# Altium schematic sheet [04] - CONNECTORS.SchDoc
size A4; DocumentNumber: 4; SheetNumber: 4; SheetTotal: 5
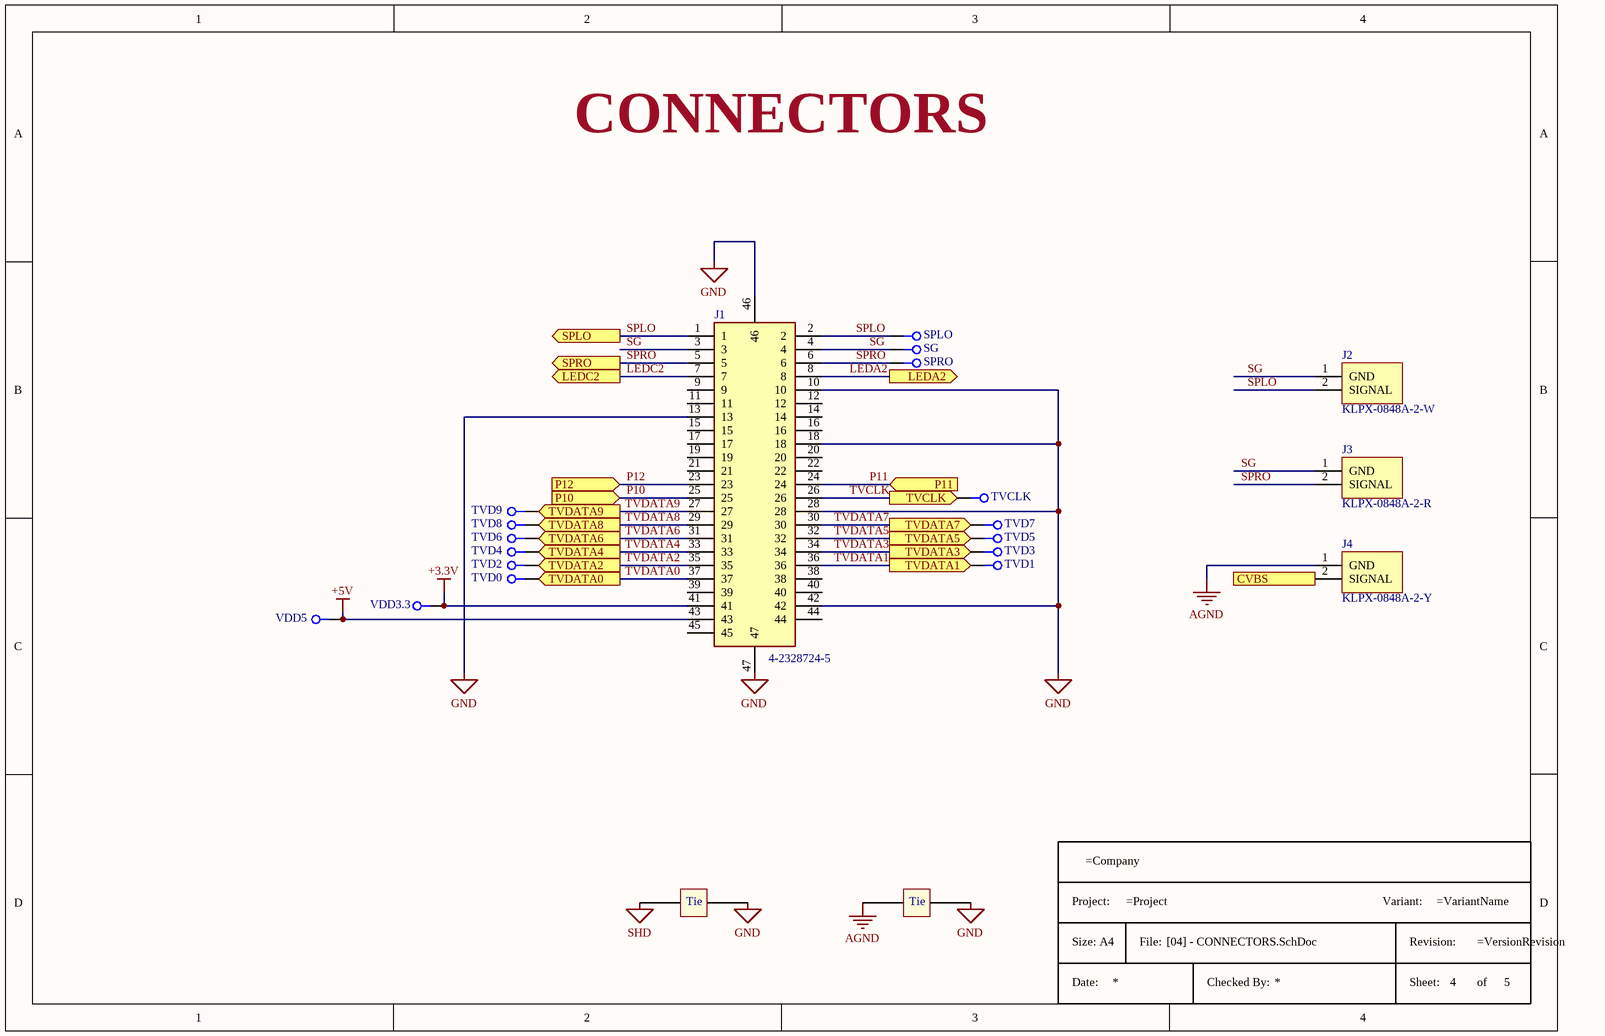
[diagram p0: [04] - CONNECTORS.SchDoc]

## Parts
*  Title Block A4  (value not drawn)  (graphical)
J1  4-2328724-5  [423287245]
J2  KLPX-0848A-2-W  [KLPX0848A2W]
J3  KLPX-0848A-2-R  [KLPX0848A2R]
J4  KLPX-0848A-2-Y  [KLPX0848A2Y]
SG  TP_25MILC  [TP_25C]  (value not drawn)  (no BOM)
SPLO  TP_25MILC  [TP_25C]  (value not drawn)  (no BOM)
SPRO  TP_25MILC  [TP_25C]  (value not drawn)  (no BOM)
T1  NET TIE  [NET_TIE]  (value not drawn)  (net tie, no BOM)
T2  NET TIE  [NET_TIE]  (value not drawn)  (net tie, no BOM)
TVCLK  TP_25MILC  [TP_25C]  (value not drawn)  (no BOM)
TVD0  TP_25MILC  [TP_25C]  (value not drawn)  (no BOM)
TVD1  TP_25MILC  [TP_25C]  (value not drawn)  (no BOM)
TVD2  TP_25MILC  [TP_25C]  (value not drawn)  (no BOM)
TVD3  TP_25MILC  [TP_25C]  (value not drawn)  (no BOM)
TVD4  TP_25MILC  [TP_25C]  (value not drawn)  (no BOM)
TVD5  TP_25MILC  [TP_25C]  (value not drawn)  (no BOM)
TVD6  TP_25MILC  [TP_25C]  (value not drawn)  (no BOM)
TVD7  TP_25MILC  [TP_25C]  (value not drawn)  (no BOM)
TVD8  TP_25MILC  [TP_25C]  (value not drawn)  (no BOM)
TVD9  TP_25MILC  [TP_25C]  (value not drawn)  (no BOM)
VDD3.3  TP_25MILC  [TP_25C]  (value not drawn)  (no BOM)
VDD5  TP_25MILC  [TP_25C]  (value not drawn)  (no BOM)

## Ports
CVBS (in), LEDA2 (out), LEDC2 (out), P10 (in), P11 (in), P12 (in), SPLO (out), SPRO (out), TVCLK (out), TVDATA0 (out), TVDATA1 (out), TVDATA2 (out), TVDATA3 (out), TVDATA4 (out), TVDATA5 (out), TVDATA6 (out), TVDATA7 (out), TVDATA8 (out), TVDATA9 (out)

## Nets
+3.3V: J1.41 VDD3.3.1
+5V: J1.43 VDD5.1
AGND: J4.1(GND) T1.1
GND: J1.10 J1.13 J1.18 J1.28 J1.42 J1.46 J1.47 T1.2 T2.2
SHD: T2.1
CVBS: J4.2(SIGNAL) ; port CVBS
LEDA2: J1.8 ; port LEDA2
LEDC2: J1.7 ; port LEDC2
P10: J1.25 ; port P10
P11: J1.24 ; port P11
P12: J1.23 ; port P12
SG: J1.3 J1.4 J2.1(GND) J3.1(GND) SG.1
SPLO: J1.1 J1.2 J2.2(SIGNAL) SPLO.1 ; port SPLO
SPRO: J1.5 J1.6 J3.2(SIGNAL) SPRO.1 ; port SPRO
TVCLK: J1.26 TVCLK.1 ; port TVCLK
TVDATA0: J1.37 TVD0.1 ; port TVDATA0
TVDATA1: J1.36 TVD1.1 ; port TVDATA1
TVDATA2: J1.35 TVD2.1 ; port TVDATA2
TVDATA3: J1.34 TVD3.1 ; port TVDATA3
TVDATA4: J1.33 TVD4.1 ; port TVDATA4
TVDATA5: J1.32 TVD5.1 ; port TVDATA5
TVDATA6: J1.31 TVD6.1 ; port TVDATA6
TVDATA7: J1.30 TVD7.1 ; port TVDATA7
TVDATA8: J1.29 TVD8.1 ; port TVDATA8
TVDATA9: J1.27 TVD9.1 ; port TVDATA9

Not connected (* = marked no-connect by the designer): J1 9 11 12 14 15 16 17 19 20 21 22 38 39 40 44 45

## Notes on the sheet
- CONNECTORS
- (in symbol NET_TIE) Tie
- (in symbol Title Block A4) Project:; Variant:; Size: A4; File:; Revision:; Date:; Checked By:; Sheet:; of

## Library data of the parts
J1 = 4-2328724-5: FPC Connector; 0.3mm pitch front flip FPC; 45pos; Manufacturer: TE Connectivity AMP; Actuator Material: Thermoplastic; Number of Positions: 45; Voltage Rating: 30V; Current Rating: 500mA; Supplier 1: Farnell; Manufacturer Part Number: 4-2328724-5; RoHS: No; Category: FFC / FPC; Stock 1: 408; Pricing 1: 1=0,23000, 125=0,21700, 375=0,20400, 1000=0,19100, 2500=0,18700 (EUR); Mount: Surface Mount; Contact Material: Copper Alloy; Contact Plating: Gold; Housing Material: Thermoplastic; Housing Color: Natural; Min Operating Temperature: -40°C; Max Operating Temperature: 85°C; Packaging: Tape and Reel; Termination: Solder; Flammability Rating: UL94 V-0; ComponentLink1URL: https://www.te.com/commerce/DocumentDelivery/DDEController?Action=srchrtrv&amp;DocNm=2328724&amp;DocType=Customer+Drawing&amp;DocLang=English&src-supplier=Digi-Key; ComponentLink1Description: https://www.te.com/commerce/DocumentDelivery/DDEController?Action=srchrtrv&amp;DocNm=2328724&amp;DocType=Customer+Drawing&amp;DocLang=English&src-supplier=Digi-Key; Supplier Part Number 1: 2946027
J2 = KLPX-0848A-2-W: Conn RCA F 2 POS 4.5mm Solder RA Thru-Hole 2 Terminal 1 Port; Manufacturer: Kycon; Number of Ports: 1; Gender: Female; Voltage Rating: 500V; Number of Contacts: 2; Supplier 1: Mouser; Manufacturer Part Number: KLPX-0848A-2-W; RoHS: Yes; Category: Connectors; Pricing 1: 1=0,78000, 10=0,61500, 50=0,61500, 100=0,53400, 1000=0,42700, 10000=0,34700 (USD); Mount: Through Hole; Color: White; Contact Material: Brass; Contact Plating: Tin; Termination: Through Hole; Orientation: Right Angle; Package Quantity: 500; Packaging: Bag; Pitch: 4.5mm; Radiation Hardening: No; ComponentLink1URL: http://www.mouser.com/ds/2/222/KLPX-334830.pdf?src-supplier=Mouser; ComponentLink1Description: http://www.mouser.com/ds/2/222/KLPX-334830.pdf?src-supplier=Mouser; ComponentLink2URL: http://domino2.kycon.com/catalog_PDF/Standard%20Catalog%20page/RCA%20Phono%20Jacks/SKLPX.pdf?src-supplier=Avnet; ComponentLink2Description: http://domino2.kycon.com/catalog_PDF/Standard%20Catalog%20page/RCA%20Phono%20Jacks/SKLPX.pdf?src-supplier=Avnet; ComponentLink3URL: http://domino2.kycon.com/catalog_PDF/Standard%20Catalog%20page/RCA%20Phono%20Jacks/SKLPX.pdf?src-supplier=Avnet+Europe; ComponentLink3Description: http://domino2.kycon.com/catalog_PDF/Standard%20Catalog%20page/RCA%20Phono%20Jacks/SKLPX.pdf?src-supplier=Avnet+Europe; Supplier Part Number 1: 806-KLPX-0848A-2-W
J3 = KLPX-0848A-2-R: Conn RCA F 2 POS 4.5mm Solder RA Thru-Hole 2 Terminal 1 Port; Manufacturer: Kycon; Number of Ports: 1; Gender: Female; Voltage Rating: 500V; Number of Contacts: 2; Supplier 1: Mouser; Manufacturer Part Number: KLPX-0848A-2-R; RoHS: Yes; Category: Connectors; Stock 1: 694; Pricing 1: 1=0,78000, 10=0,61500, 50=0,61500, 100=0,53400, 1000=0,42800, 10000=0,34800 (USD); Mount: Through Hole; Color: Red; Contact Material: Brass; Contact Plating: Tin; Orientation: Right Angle; Termination: Through Hole; Packaging: Bag; Package Quantity: 500; Pitch: 4.5mm; Radiation Hardening: No; ComponentLink1URL: http://www.mouser.com/ds/2/222/KLPX-334830.pdf?src-supplier=Mouser; ComponentLink1Description: http://www.mouser.com/ds/2/222/KLPX-334830.pdf?src-supplier=Mouser; ComponentLink2URL: http://domino2.kycon.com/catalog_PDF/Standard%20Catalog%20page/RCA%20Phono%20Jacks/SKLPX.pdf?src-supplier=Avnet; ComponentLink2Description: http://domino2.kycon.com/catalog_PDF/Standard%20Catalog%20page/RCA%20Phono%20Jacks/SKLPX.pdf?src-supplier=Avnet; ComponentLink3URL: http://domino2.kycon.com/catalog_PDF/Standard%20Catalog%20page/RCA%20Phono%20Jacks/SKLPX.pdf?src-supplier=Avnet+Europe; ComponentLink3Description: http://domino2.kycon.com/catalog_PDF/Standard%20Catalog%20page/RCA%20Phono%20Jacks/SKLPX.pdf?src-supplier=Avnet+Europe; Supplier Part Number 1: 806-KLPX-0848A-2-R
J4 = KLPX-0848A-2-Y: Conn RCA F 2 POS 4.5mm Solder RA Thru-Hole 2 Terminal 1 Port; Manufacturer: Kycon; Number of Ports: 1; Gender: Female; Voltage Rating: 500V; Number of Contacts: 2; Supplier 1: Mouser; Manufacturer Part Number: KLPX-0848A-2-Y; RoHS: Yes; Category: Connectors; Stock 1: 528; Pricing 1: 1=0,78000, 10=0,61500, 50=0,61500, 100=0,53400, 1000=0,42700, 10000=0,34700 (USD); Mount: Through Hole; Color: Yellow; Contact Material: Brass; Contact Plating: Tin; Termination: Through Hole; Orientation: Right Angle; Package Quantity: 500; Packaging: Bag; Pitch: 4.5mm; Radiation Hardening: No; ComponentLink1URL: https://datasheet.ciiva.com/12540/klpx-0848a-2-x-183296-12540000.pdf?src-supplier=Mouser; ComponentLink1Description: https://datasheet.ciiva.com/12540/klpx-0848a-2-x-183296-12540000.pdf?src-supplier=Mouser; Supplier Part Number 1: 806-KLPX-0848A-2-Y
SG SPLO SPRO TVCLK TVD0-TVD9 VDD3.3 VDD5 = TP_25MILC: Test Point 25mil
T1 T2 = NET_TIE: .PCBCheck: *; .SCHCheck: *